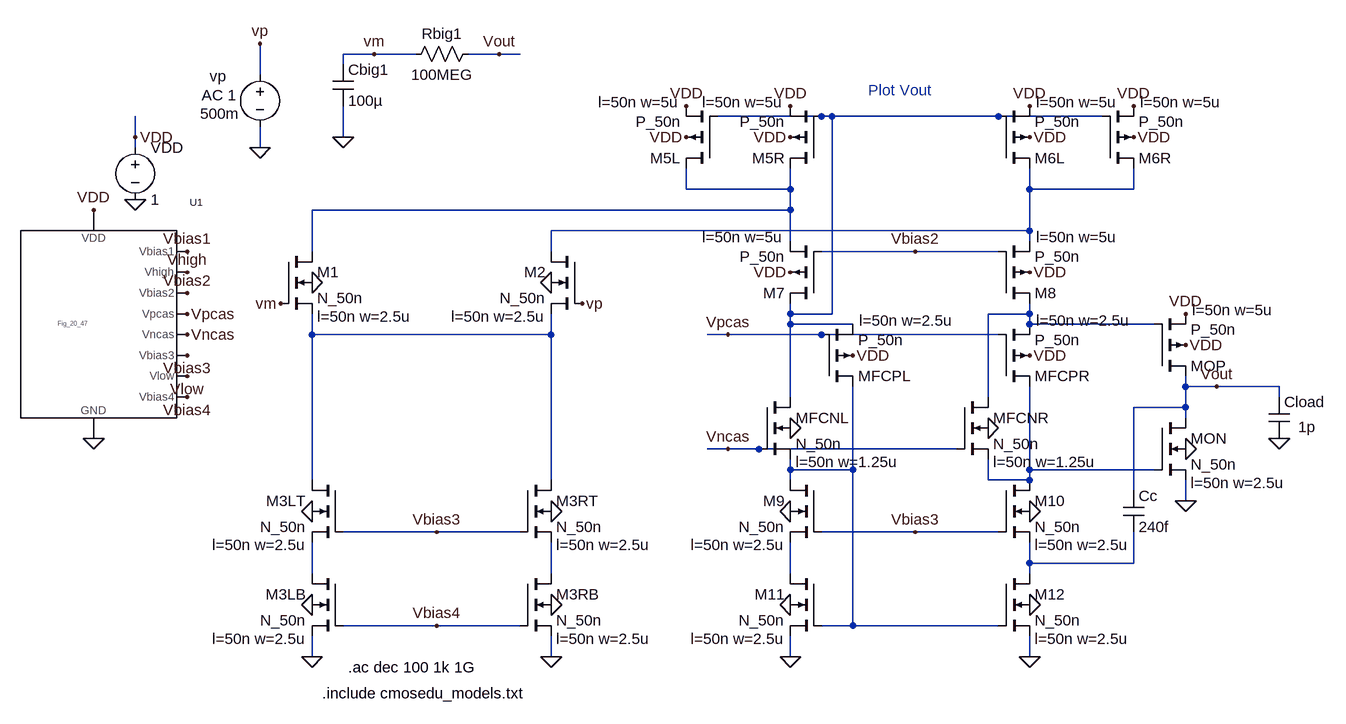
[diagram p0: schematic Fig24_47_AC.asc]
Fig24_47_AC.asc, the LTspice schematic file:
Version 4
SHEET 1 3296 680
WIRE 1728 -1104 1680 -1104
WIRE 1792 -1104 1728 -1104
WIRE 1920 -1104 1872 -1104
WIRE 1952 -1104 1920 -1104
WIRE 1680 -1088 1680 -1104
WIRE 1552 -1072 1552 -1120
WIRE 2416 -1008 2256 -1008
WIRE 2432 -1008 2416 -1008
WIRE 2688 -1008 2432 -1008
WIRE 2848 -1008 2688 -1008
WIRE 1360 -976 1360 -1008
WIRE 1680 -976 1680 -1024
WIRE 1360 -960 1360 -976
WIRE 1552 -960 1552 -992
WIRE 2208 -896 2208 -928
WIRE 2368 -896 2368 -928
WIRE 2368 -896 2208 -896
WIRE 2736 -896 2736 -928
WIRE 2896 -896 2896 -928
WIRE 2896 -896 2736 -896
WIRE 2368 -864 2368 -896
WIRE 2368 -864 1632 -864
WIRE 2736 -832 2736 -896
WIRE 2736 -832 2000 -832
WIRE 2368 -816 2368 -864
WIRE 2736 -816 2736 -832
WIRE 1632 -800 1632 -864
WIRE 2000 -800 2000 -832
WIRE 2560 -800 2416 -800
WIRE 2688 -800 2560 -800
WIRE 2368 -704 2368 -720
WIRE 2432 -704 2432 -1008
WIRE 2432 -704 2368 -704
WIRE 2736 -704 2736 -720
WIRE 2736 -704 2672 -704
WIRE 2368 -688 2368 -704
WIRE 2464 -688 2368 -688
WIRE 2736 -688 2736 -704
WIRE 2928 -688 2736 -688
WIRE 1632 -672 1632 -704
WIRE 2000 -672 2000 -704
WIRE 2000 -672 1632 -672
WIRE 2272 -672 2240 -672
WIRE 2416 -672 2272 -672
WIRE 2688 -672 2416 -672
WIRE 2976 -592 2976 -608
WIRE 3024 -592 2976 -592
WIRE 3120 -592 3024 -592
WIRE 2368 -576 2368 -688
WIRE 2672 -576 2672 -704
WIRE 3120 -576 3120 -592
WIRE 2976 -560 2976 -592
WIRE 2976 -560 2896 -560
WIRE 2976 -544 2976 -560
WIRE 2272 -496 2240 -496
WIRE 2320 -496 2272 -496
WIRE 2624 -496 2320 -496
WIRE 2368 -464 2368 -480
WIRE 2464 -464 2464 -592
WIRE 2464 -464 2368 -464
WIRE 2736 -464 2736 -592
WIRE 2928 -464 2736 -464
WIRE 1632 -448 1632 -672
WIRE 2000 -448 2000 -672
WIRE 2368 -448 2368 -464
WIRE 2672 -448 2672 -480
WIRE 2736 -448 2736 -464
WIRE 2736 -448 2672 -448
WIRE 2896 -432 2896 -560
WIRE 2976 -416 2976 -448
WIRE 1824 -368 1680 -368
WIRE 1952 -368 1824 -368
WIRE 2560 -368 2416 -368
WIRE 2688 -368 2560 -368
WIRE 2736 -320 2736 -352
WIRE 2896 -320 2896 -368
WIRE 2896 -320 2736 -320
WIRE 1632 -304 1632 -352
WIRE 2000 -304 2000 -352
WIRE 2368 -304 2368 -352
WIRE 2736 -304 2736 -320
WIRE 1824 -224 1680 -224
WIRE 1952 -224 1824 -224
WIRE 2464 -224 2464 -464
WIRE 2464 -224 2416 -224
WIRE 2688 -224 2464 -224
WIRE 1632 -176 1632 -208
WIRE 2000 -176 2000 -208
WIRE 2368 -176 2368 -208
WIRE 2736 -176 2736 -208
FLAG 1360 -880 0
FLAG 1360 -976 VDD
FLAG 1296 -864 VDD
FLAG 1296 -512 0
FLAG 1440 -800 Vbias1
FLAG 1440 -768 Vhigh
FLAG 1440 -736 Vbias2
FLAG 1440 -640 Vbias3
FLAG 1440 -704 Vpcas
FLAG 1440 -672 Vncas
FLAG 1440 -576 Vbias4
FLAG 1440 -608 Vlow
FLAG 2896 -976 VDD
FLAG 1632 -752 0
FLAG 2000 -752 0
FLAG 1584 -720 vm
FLAG 2048 -720 vp
FLAG 2000 -400 0
FLAG 2000 -256 0
FLAG 2000 -176 0
FLAG 1632 -400 0
FLAG 1632 -256 0
FLAG 1632 -176 0
FLAG 1824 -368 Vbias3
FLAG 1824 -224 Vbias4
FLAG 2736 -400 0
FLAG 2736 -256 0
FLAG 2736 -176 0
FLAG 2368 -400 0
FLAG 2368 -256 0
FLAG 2368 -176 0
FLAG 2560 -368 Vbias3
FLAG 2736 -976 VDD
FLAG 2736 -1024 VDD
FLAG 2896 -1024 VDD
FLAG 2208 -976 VDD
FLAG 2368 -976 VDD
FLAG 2368 -1024 VDD
FLAG 2208 -1024 VDD
FLAG 2736 -768 VDD
FLAG 2368 -768 VDD
FLAG 2560 -800 Vbias2
FLAG 3120 -512 0
FLAG 1552 -960 0
FLAG 1552 -1120 vp
FLAG 3024 -592 Vout
FLAG 2464 -640 VDD
FLAG 2736 -640 VDD
FLAG 2672 -528 0
FLAG 2368 -528 0
FLAG 2272 -672 Vpcas
FLAG 2272 -496 Vncas
FLAG 2976 -656 VDD
FLAG 2976 -704 VDD
FLAG 2976 -496 0
FLAG 2976 -416 0
FLAG 1680 -976 0
FLAG 1920 -1104 Vout
FLAG 1728 -1104 vm
SYMBOL voltage 1360 -976 R0
WINDOW 123 0 0 Left 2
WINDOW 39 0 0 Left 2
SYMATTR InstName VDD
SYMATTR Value 1
SYMBOL Fig_20_47 1296 -688 R0
SYMATTR InstName U1
SYMBOL pmos4 2848 -928 M180
WINDOW 123 58 102 Left 2
WINDOW 0 56 16 Left 2
SYMATTR Value2 l=50n w=5u
SYMATTR InstName M6R
SYMATTR Value P_50n
SYMBOL nmos4 1584 -800 R0
WINDOW 123 56 100 Left 2
SYMATTR Value2 l=50n w=2.5u
SYMATTR InstName M1
SYMATTR Value N_50n
SYMBOL nmos4 2048 -800 M0
WINDOW 123 56 100 Left 2
SYMATTR Value2 l=50n w=2.5u
SYMATTR InstName M2
SYMATTR Value N_50n
SYMBOL nmos4 1952 -448 R0
WINDOW 123 56 100 Left 2
SYMATTR Value2 l=50n w=2.5u
SYMATTR InstName M3RT
SYMATTR Value N_50n
SYMBOL nmos4 1952 -304 R0
WINDOW 123 56 100 Left 2
SYMATTR Value2 l=50n w=2.5u
SYMATTR InstName M3RB
SYMATTR Value N_50n
SYMBOL nmos4 1680 -448 M0
WINDOW 123 56 100 Left 2
SYMATTR Value2 l=50n w=2.5u
SYMATTR InstName M3LT
SYMATTR Value N_50n
SYMBOL nmos4 1680 -304 M0
WINDOW 123 56 100 Left 2
SYMATTR Value2 l=50n w=2.5u
SYMATTR InstName M3LB
SYMATTR Value N_50n
SYMBOL nmos4 2688 -448 R0
WINDOW 123 56 100 Left 2
SYMATTR Value2 l=50n w=2.5u
SYMATTR InstName M10
SYMATTR Value N_50n
SYMBOL nmos4 2688 -304 R0
WINDOW 123 56 100 Left 2
SYMATTR Value2 l=50n w=2.5u
SYMATTR InstName M12
SYMATTR Value N_50n
SYMBOL nmos4 2416 -448 M0
WINDOW 123 56 100 Left 2
SYMATTR Value2 l=50n w=2.5u
SYMATTR InstName M9
SYMATTR Value N_50n
SYMBOL nmos4 2416 -304 M0
WINDOW 123 56 100 Left 2
SYMATTR Value2 l=50n w=2.5u
SYMATTR InstName M11
SYMATTR Value N_50n
SYMBOL pmos4 2688 -928 M180
WINDOW 123 58 102 Left 2
WINDOW 0 56 16 Left 2
SYMATTR Value2 l=50n w=5u
SYMATTR InstName M6L
SYMATTR Value P_50n
SYMBOL pmos4 2256 -928 R180
WINDOW 123 58 102 Left 2
WINDOW 0 56 16 Left 2
SYMATTR Value2 l=50n w=5u
SYMATTR InstName M5L
SYMATTR Value P_50n
SYMBOL pmos4 2416 -928 R180
WINDOW 123 58 102 Left 2
WINDOW 0 56 16 Left 2
SYMATTR Value2 l=50n w=5u
SYMATTR InstName M5R
SYMATTR Value P_50n
SYMBOL pmos4 2688 -720 M180
WINDOW 123 58 102 Left 2
WINDOW 0 56 16 Left 2
SYMATTR Value2 l=50n w=5u
SYMATTR InstName M8
SYMATTR Value P_50n
SYMBOL pmos4 2416 -720 R180
WINDOW 123 58 102 Left 2
WINDOW 0 56 16 Left 2
SYMATTR Value2 l=50n w=5u
SYMATTR InstName M7
SYMATTR Value P_50n
SYMBOL cap 3104 -576 R0
WINDOW 3 45 46 Left 2
SYMATTR Value 1p
SYMATTR InstName Cload
SYMBOL voltage 1552 -1088 R0
WINDOW 0 -77 18 Left 2
WINDOW 3 -92 76 Left 2
WINDOW 123 -90 47 Left 2
WINDOW 39 0 0 Left 2
SYMATTR InstName vp
SYMATTR Value 500m
SYMATTR Value2 AC 1
SYMBOL pmos4 2416 -592 M180
WINDOW 123 58 102 Left 2
WINDOW 0 56 16 Left 2
SYMATTR Value2 l=50n w=2.5u
SYMATTR InstName MFCPL
SYMATTR Value P_50n
SYMBOL pmos4 2688 -592 M180
WINDOW 123 58 102 Left 2
WINDOW 0 56 16 Left 2
SYMATTR Value2 l=50n w=2.5u
SYMATTR InstName MFCPR
SYMATTR Value P_50n
SYMBOL nmos4 2624 -576 R0
WINDOW 123 56 100 Left 2
SYMATTR Value2 l=50n w=1.25u
SYMATTR InstName MFCNR
SYMATTR Value N_50n
SYMBOL nmos4 2320 -576 R0
WINDOW 123 56 100 Left 2
SYMATTR Value2 l=50n w=1.25u
SYMATTR InstName MFCNL
SYMATTR Value N_50n
SYMBOL pmos4 2928 -608 M180
WINDOW 123 58 102 Left 2
WINDOW 0 56 16 Left 2
SYMATTR Value2 l=50n w=5u
SYMATTR InstName MOP
SYMATTR Value P_50n
SYMBOL nmos4 2928 -544 R0
WINDOW 123 56 100 Left 2
SYMATTR Value2 l=50n w=2.5u
SYMATTR InstName MON
SYMATTR Value N_50n
SYMBOL cap 2880 -432 R0
SYMATTR InstName Cc
SYMATTR Value 240f
SYMBOL cap 1664 -1088 R0
SYMATTR InstName Cbig1
SYMATTR Value 100µ
SYMBOL res 1776 -1088 R270
WINDOW 0 32 56 VTop 2
WINDOW 3 0 56 VBottom 2
SYMATTR InstName Rbig1
SYMATTR Value 100MEG
TEXT 1648 -120 Left 2 !.include cmosedu_models.txt
TEXT 2488 -1048 Left 2 ;Plot Vout
TEXT 1688 -160 Left 2 !.ac dec 100 1k 1G

The netlist it stands for:
* Fig24_47_AC.asc
VDD VDD 0 1
XU1 Vbias1 Vhigh Vbias2 Vpcas Vncas Vbias3 Vlow Vbias4 VDD 0 Fig_20_47  ; pins Vbias1 Vhigh Vbias2 Vpcas Vncas Vbias3 Vlow Vbias4 VDD GND
M6R N003 N001 VDD VDD P_50n l=50n w=5u
M1 N002 vm N005 0 N_50n l=50n w=2.5u
M2 N003 vp N005 0 N_50n l=50n w=2.5u
M3RT N005 Vbias3 N010 0 N_50n l=50n w=2.5u
M3RB N010 Vbias4 0 0 N_50n l=50n w=2.5u
M3LT N005 Vbias3 N009 0 N_50n l=50n w=2.5u
M3LB N009 Vbias4 0 0 N_50n l=50n w=2.5u
M10 N007 Vbias3 N008 0 N_50n l=50n w=2.5u
M12 N008 N006 0 0 N_50n l=50n w=2.5u
M9 N006 Vbias3 N011 0 N_50n l=50n w=2.5u
M11 N011 N006 0 0 N_50n l=50n w=2.5u
M6L N003 N001 VDD VDD P_50n l=50n w=5u
M5L N002 N001 VDD VDD P_50n l=50n w=5u
M5R N002 N001 VDD VDD P_50n l=50n w=5u
M8 N004 Vbias2 N003 VDD P_50n l=50n w=5u
M7 N001 Vbias2 N002 VDD P_50n l=50n w=5u
Cload Vout 0 1p
vp vp 0 500m AC 1
MFCPL N006 Vpcas N001 VDD P_50n l=50n w=2.5u
MFCPR N007 Vpcas N004 VDD P_50n l=50n w=2.5u
MFCNR N004 Vncas N007 0 N_50n l=50n w=1.25u
MFCNL N001 Vncas N006 0 N_50n l=50n w=1.25u
MOP Vout N004 VDD VDD P_50n l=50n w=5u
MON Vout N007 0 0 N_50n l=50n w=2.5u
Cc Vout N008 240f
Cbig1 vm 0 100µ
Rbig1 vm Vout 100MEG
.model NMOS NMOS
.model PMOS PMOS
.lib standard.mos
.include cmosedu_models.txt
* Plot Vout
.ac dec 100 1k 1G
.backanno
.end